# EAGLE schematic LCD_16x2_with_8051 (EAGLE 9.6.2)
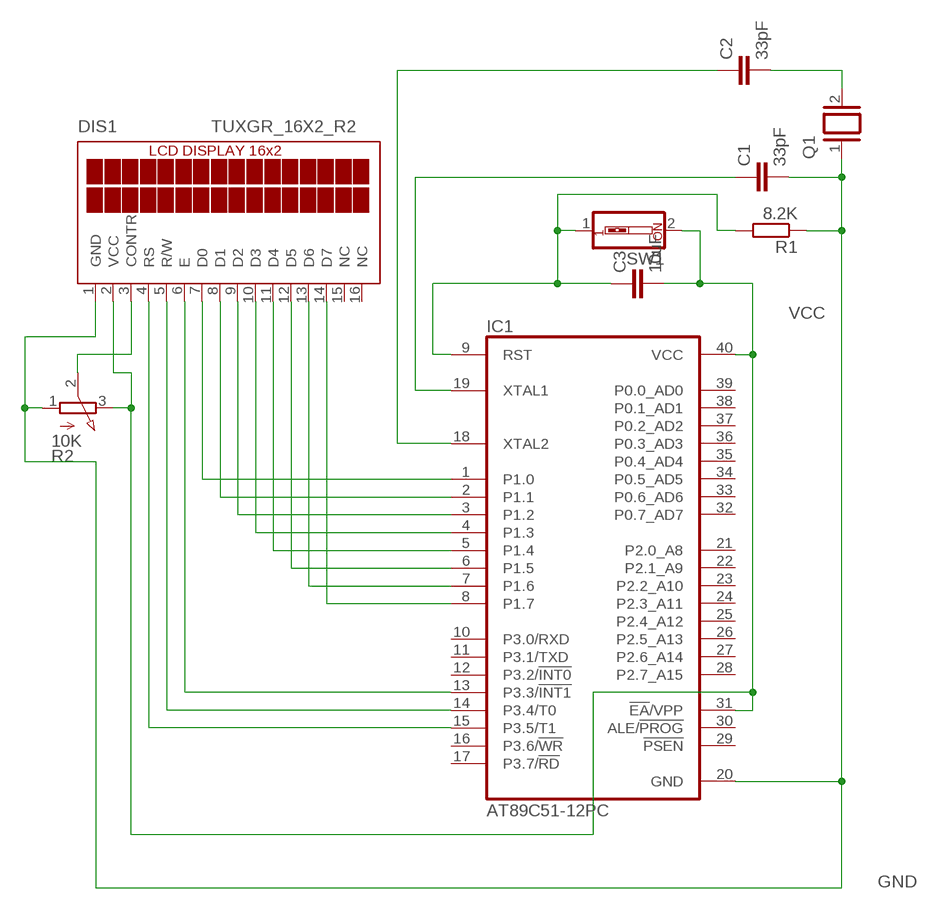
[diagram p0: schematic, sheet 1]

## Parts
C1  33pF  C-EU025-025X050  [C025-025X050]
C2  33pF  C-EU025-025X050  [C025-025X050]
C3  10uF  C-EU025-025X050  [C025-025X050]
DIS1  TUXGR_16X2_R2  [TUXGR_16X2_R2]
IC1  AT89C51-12PC  [DIL40]
Q1  XTAL  [Q]
R1  8.2K  R-EU_0204/7  [0204/7]
R2  10K  3RP/1610N  [3RP/1610N]
SW1  SW_DIP-1  [EDG-01]

## Nets
GND: C1.2 DIS1.1(GND) IC1.20(GND) Q1.1 R1.1 R2.1(A)
N$1: DIS1.7(D0) IC1.1(P1.0)
N$2: DIS1.8(D1) IC1.2(P1.1)
N$3: DIS1.9(D2) IC1.3(P1.2)
N$5: DIS1.10(D3) IC1.4(P1.3)
N$6: DIS1.11(D4) IC1.5(P1.4)
N$7: DIS1.12(D5) IC1.6(P1.5)
N$8: DIS1.13(D6) IC1.7(P1.6)
N$9: DIS1.14(D7) IC1.8(P1.7)
N$10: DIS1.6(E) IC1.13(P3.3/!INT1)
N$11: DIS1.5(R/W) IC1.14(P3.4/T0)
N$12: DIS1.4(RS) IC1.15(P3.5/T1)
N$13: DIS1.3(CONTR) R2.2(S)
N$15: C3.1 IC1.9(RST) R1.2 SW1.1
N$16: C2.1 IC1.18(XTAL2)
N$18: C1.1 IC1.19(XTAL1)
N$19: C2.2 Q1.2
VCC: C3.2 DIS1.2(VCC) IC1.31(!EA!/VPP) IC1.40(VCC) R2.3(E) SW1.2
Unconnected: DIS1.15(NC) DIS1.16(NC) IC1.10(P3.0/RXD) IC1.11(P3.1/TXD) IC1.12(P3.2/!INT0) IC1.16(P3.6/!WR) IC1.17(P3.7/!RD) IC1.21(P2.0_A8) IC1.22(P2.1_A9) IC1.23(P2.2_A10) IC1.24(P2.3_A11) IC1.25(P2.4_A12) IC1.26(P2.5_A13) IC1.27(P2.6_A14) IC1.28(P2.7_A15) IC1.29(!PSEN) IC1.30(ALE/!PROG) IC1.32(P0.7_AD7) IC1.33(P0.6_AD6) IC1.34(P0.5_AD5) IC1.35(P0.4_AD4) IC1.36(P0.3_AD3) IC1.37(P0.2_AD2) IC1.38(P0.1_AD1) IC1.39(P0.0_AD0)

## Library data of the parts
C1-C3 = rcl:C-EU: CAPACITOR, European symbol; SPICEPREFIX: C
DIS1 = display-lcd:TUXGR_16X2_R2: Tuxgraphics LCD display 16x2 characters reflective, without background light Source: tuxgr_12x2_r2.pdf; OC_FARNELL: unknown; OC_NEWARK: unknown
IC1 = atmel:AT89C51-*: 8-bit Microcontroller with 4K Bytes Flash Not Recommended for New Designs. Use AT89S51. Source: http://www.atmel.com/dyn/resources/prod_documents/doc0265.; OC_FARNELL: unknown; OC_NEWARK: unknown
Q1 = special:XTAL: CRYSTAL
R1 = rcl:R-EU_: RESISTOR, European symbol; SPICEPREFIX: R
R2 = pot:3RP/1610N: 16mm Potentiometer one level Source: http://www.alphapotentiometers.net/html/16mm_pot_2.html
SW1 = special:SW_DIP-1: DIP SWITCH